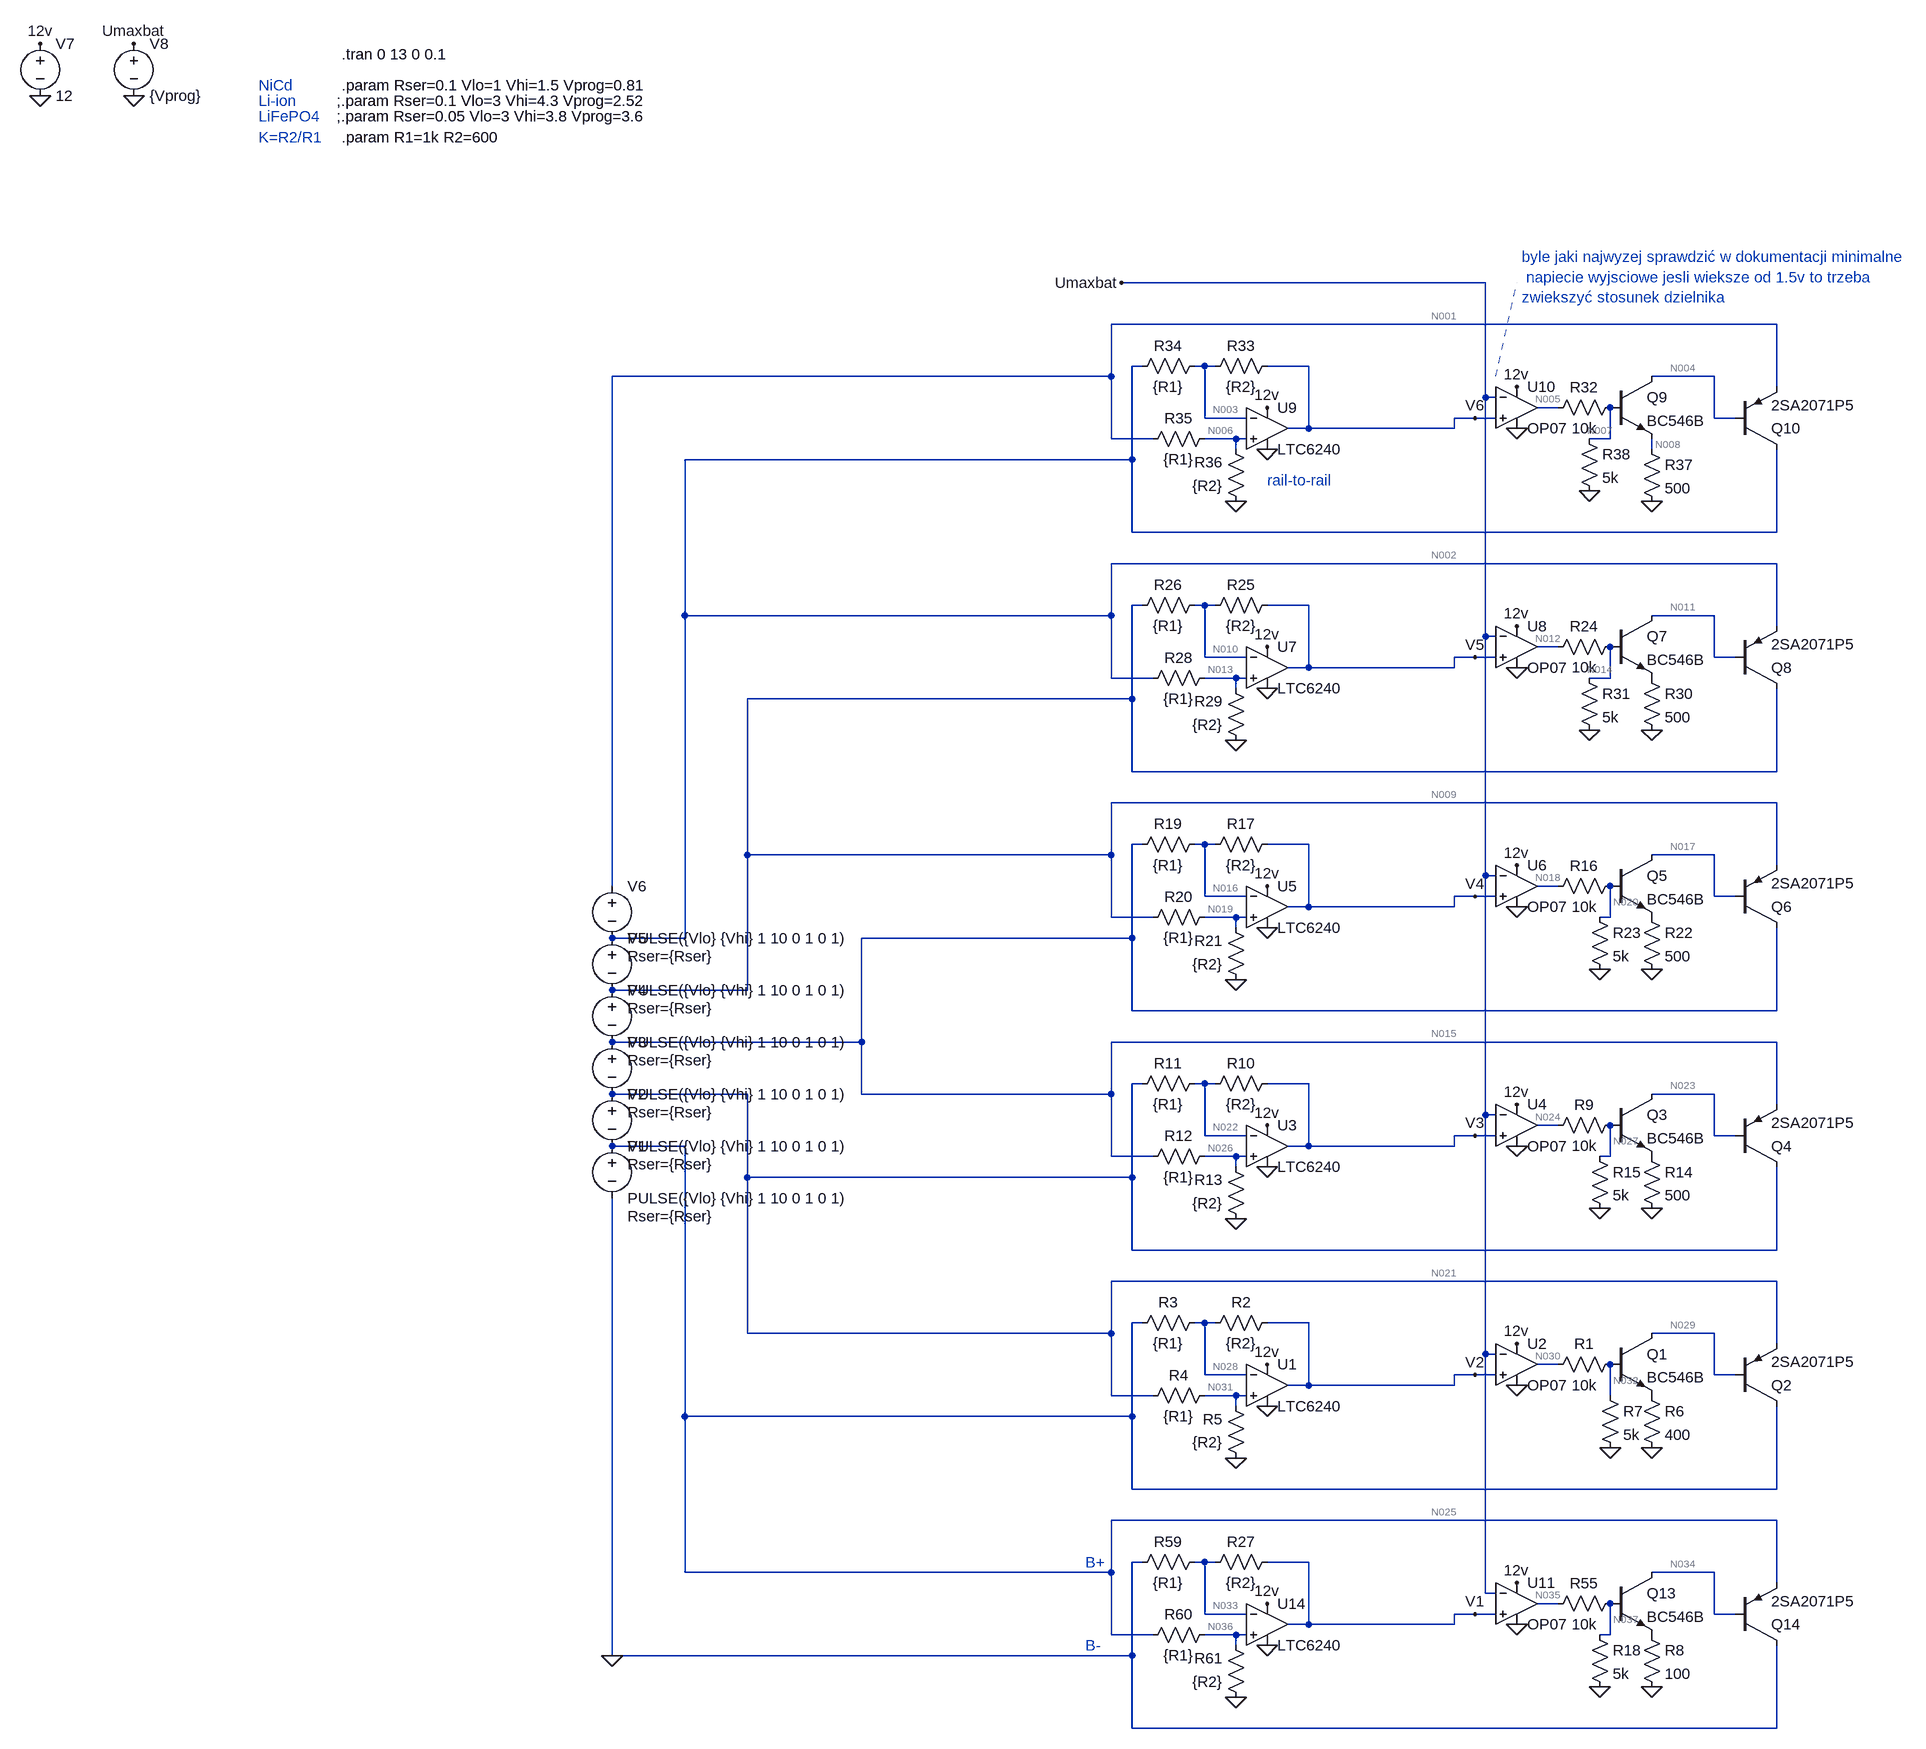
[diagram p0: schematic balanser_ostateczna_wersja.asc]
* balanser_ostateczna_wersja.asc
V1 N025 0 PULSE({Vlo} {Vhi} 1 10 0 1 0 1) Rser={Rser}
V7 12v 0 12
V8 Umaxbat 0 {Vprog}
R55 N037 N035 10k
R27 V1 N033 {R2}
R59 N033 0 {R1}
R60 N036 N025 {R1}
R61 0 N036 {R2}
Q13 N034 N037 P001 0 BC546B
Q14 0 N034 N025 0 2SA2071P5
V2 N021 N025 PULSE({Vlo} {Vhi} 1 10 0 1 0 1) Rser={Rser}
V3 N015 N021 PULSE({Vlo} {Vhi} 1 10 0 1 0 1) Rser={Rser}
V4 N009 N015 PULSE({Vlo} {Vhi} 1 10 0 1 0 1) Rser={Rser}
V5 N002 N009 PULSE({Vlo} {Vhi} 1 10 0 1 0 1) Rser={Rser}
V6 N001 N002 PULSE({Vlo} {Vhi} 1 10 0 1 0 1) Rser={Rser}
* U14: LTC6240 (symbol OpAmps\LTC6240 not available, pins judged from their places): In+=N036 In-=N033 V+=12v V-=0 OUT=V1
XU11 V1 Umaxbat 12v 0 N035 LT1001  ; OP07, pins In+ In- V+ V- OUT
R8 P001 0 100
R18 N037 0 5k
R1 N032 N030 10k
R2 V2 N028 {R2}
R3 N028 N025 {R1}
R4 N031 N021 {R1}
R5 0 N031 {R2}
Q1 N029 N032 P002 0 BC546B
Q2 N025 N029 N021 0 2SA2071P5
* U1: LTC6240 (symbol OpAmps\LTC6240 not available, pins judged from their places): In+=N031 In-=N028 V+=12v V-=0 OUT=V2
XU2 V2 Umaxbat 12v 0 N030 LT1001  ; OP07, pins In+ In- V+ V- OUT
R6 P002 0 400
R7 N032 0 5k
R9 N027 N024 10k
R10 V3 N022 {R2}
R11 N022 N021 {R1}
R12 N026 N015 {R1}
R13 0 N026 {R2}
Q3 N023 N027 P003 0 BC546B
Q4 N021 N023 N015 0 2SA2071P5
* U3: LTC6240 (symbol OpAmps\LTC6240 not available, pins judged from their places): In+=N026 In-=N022 V+=12v V-=0 OUT=V3
XU4 V3 Umaxbat 12v 0 N024 LT1001  ; OP07, pins In+ In- V+ V- OUT
R14 P003 0 500
R15 N027 0 5k
R16 N020 N018 10k
R17 V4 N016 {R2}
R19 N016 N015 {R1}
R20 N019 N009 {R1}
R21 0 N019 {R2}
Q5 N017 N020 P004 0 BC546B
Q6 N015 N017 N009 0 2SA2071P5
* U5: LTC6240 (symbol OpAmps\LTC6240 not available, pins judged from their places): In+=N019 In-=N016 V+=12v V-=0 OUT=V4
XU6 V4 Umaxbat 12v 0 N018 LT1001  ; OP07, pins In+ In- V+ V- OUT
R22 P004 0 500
R23 N020 0 5k
R24 N014 N012 10k
R25 V5 N010 {R2}
R26 N010 N009 {R1}
R28 N013 N002 {R1}
R29 0 N013 {R2}
Q7 N011 N014 P005 0 BC546B
Q8 N009 N011 N002 0 2SA2071P5
* U7: LTC6240 (symbol OpAmps\LTC6240 not available, pins judged from their places): In+=N013 In-=N010 V+=12v V-=0 OUT=V5
XU8 V5 Umaxbat 12v 0 N012 LT1001  ; OP07, pins In+ In- V+ V- OUT
R30 P005 0 500
R31 N014 0 5k
R32 N007 N005 10k
R33 V6 N003 {R2}
R34 N003 N002 {R1}
R35 N006 N001 {R1}
R36 0 N006 {R2}
Q9 N004 N007 N008 0 BC546B
Q10 N002 N004 N001 0 2SA2071P5
* U9: LTC6240 (symbol OpAmps\LTC6240 not available, pins judged from their places): In+=N006 In-=N003 V+=12v V-=0 OUT=V6
XU10 V6 Umaxbat 12v 0 N005 LT1001  ; OP07, pins In+ In- V+ V- OUT
R37 N008 0 500
R38 N007 0 5k
.model NPN NPN
.model PNP PNP
.lib standard.bjt
.tran 0 13 0 0.1
* B+
* B-
.param Rser=0.1 Vlo=1 Vhi=1.5 Vprog=0.81
* NiCd
* Li-ion
;.param Rser=0.1 Vlo=3 Vhi=4.3 Vprog=2.52
* LiFePO4
;.param Rser=0.05 Vlo=3 Vhi=3.8 Vprog=3.6
* K=R2/R1
.param R1=1k R2=600
* rail-to-rail
* byle jaki najwyzej sprawdzić w dokumentacji minimalne
*  napiecie wyjsciowe jesli wieksze od 1.5v to trzeba
* zwiekszyć stosunek dzielnika
.lib LTC.lib
.backanno
.end

* Results of the author's LTspice run, read from the files saved beside the schematic
* Operating Point, zero values left out:
*   V(n025) = 997.9 mV
*   V(12v) = 12 V
*   V(umaxbat) = 810 mV
*   V(n037) = 309.6 mV
*   V(n035) = 928.8 mV
*   V(v1) = 598.8 mV
*   V(n033) = 374.2 mV
*   V(n036) = 374.2 mV
*   V(n034) = 654.7 mV
*   V(p001) = 342.9 nV
*   V(n021) = 1.996 V
*   V(n015) = 2.994 V
*   V(n009) = 3.993 V
*   V(n002) = 4.992 V
*   V(n001) = 5.991 V
*   V(n032) = 309.6 mV
*   V(n030) = 928.8 mV
*   V(v2) = 598.8 mV
*   V(n028) = 748.5 mV
*   V(n031) = 748.5 mV
*   V(n029) = 1.652 V
*   V(p002) = 1.393 µV
*   V(n027) = 309.6 mV
*   V(n024) = 928.8 mV
*   V(v3) = 599 mV
*   V(n022) = 1.123 V
*   V(n026) = 1.123 V
*   V(n023) = 2.65 V
*   V(p003) = 1.769 µV
*   V(n020) = 309.6 mV
*   V(n018) = 928.8 mV
*   V(v4) = 599.2 mV
*   V(n016) = 1.497 V
*   V(n019) = 1.497 V
*   V(n017) = 3.648 V
*   V(p004) = 1.796 µV
*   V(n014) = 309.6 mV
*   V(n012) = 928.8 mV
*   V(v5) = 599.4 mV
*   V(n010) = 1.872 V
*   V(n013) = 1.872 V
*   V(n011) = 4.647 V
*   V(p005) = 1.823 µV
*   V(n007) = 309.6 mV
*   V(n005) = 928.8 mV
*   V(v6) = 599.8 mV
*   V(n003) = 2.247 V
*   V(n006) = 2.247 V
*   V(n004) = 5.646 V
*   V(n008) = 1.85 µV
*   Ic(Q13) = 3.409 nA
*   Ib(Q13) = 19.94 pA
*   Ie(Q13) = -3.429 nA
*   Ic(Q1) = 3.464 nA
*   Ib(Q1) = 18.94 pA
*   Ie(Q1) = -3.483 nA
*   Ic(Q3) = 3.519 nA
*   Ib(Q3) = 17.94 pA
*   Ie(Q3) = -3.537 nA
*   Ic(Q5) = 3.575 nA
*   Ib(Q5) = 16.95 pA
*   Ie(Q5) = -3.592 nA
*   Ic(Q7) = 3.63 nA
*   Ib(Q7) = 15.95 pA
*   Ie(Q7) = -3.646 nA
*   Ic(Q9) = 3.685 nA
*   Ib(Q9) = 14.95 pA
*   Ie(Q9) = -3.7 nA
*   Ic(Q14) = -406.5 nA
*   Ib(Q14) = -3.409 nA
*   Ie(Q14) = 409.9 nA
*   Ic(Q2) = -414.2 nA
*   Ib(Q2) = -3.464 nA
*   Ie(Q2) = 417.7 nA
*   Ic(Q4) = -422 nA
*   Ib(Q4) = -3.519 nA
*   Ie(Q4) = 425.6 nA
*   Ic(Q6) = -429.9 nA
*   Ib(Q6) = -3.575 nA
*   Ie(Q6) = 433.4 nA
*   Ic(Q8) = -437.7 nA
*   Ib(Q8) = -3.63 nA
*   Ie(Q8) = 441.3 nA
*   Ic(Q10) = -445.6 nA
*   Ib(Q10) = -3.685 nA
*   Ie(Q10) = 449.3 nA
*   I(R55) = -61.92 µA
*   I(R27) = 374.2 µA
*   I(R59) = 374.2 µA
*   I(R60) = -623.7 µA
*   I(R61) = -623.7 µA
*   I(R8) = 3.429 nA
*   I(R18) = 61.92 µA
*   I(R1) = -61.92 µA
*   I(R2) = -249.5 µA
*   I(R3) = -249.5 µA
*   I(R4) = -1.247 mA
*   I(R5) = -1.247 mA
*   I(R6) = 3.483 nA
*   I(R7) = 61.92 µA
*   I(R9) = -61.92 µA
*   I(R10) = -873.1 µA
*   I(R11) = -873.1 µA
*   I(R12) = -1.871 mA
*   I(R13) = -1.871 mA
*   I(R14) = 3.537 nA
*   I(R15) = 61.92 µA
*   I(R16) = -61.92 µA
*   I(R17) = -1.497 mA
*   I(R19) = -1.497 mA
*   I(R20) = -2.495 mA
*   I(R21) = -2.495 mA
*   I(R22) = 3.592 nA
*   I(R23) = 61.92 µA
*   I(R24) = -61.92 µA
*   I(R25) = -2.121 mA
*   I(R26) = -2.121 mA
*   I(R28) = -3.12 mA
*   I(R29) = -3.12 mA
*   I(R30) = 3.646 nA
*   I(R31) = 61.92 µA
*   I(R32) = -61.92 µA
*   I(R33) = -2.745 mA
*   I(R34) = -2.745 mA
*   I(R35) = -3.745 mA
*   I(R36) = -3.745 mA
*   I(R37) = 3.7 nA
*   I(R38) = 61.92 µA
*   I(V1) = -20.59 mA
*   I(V7) = -32.1 mA
*   I(V8) = -17.02 nA
*   I(V2) = -19.72 mA
*   I(V3) = -17.59 mA
*   I(V4) = -14.23 mA
*   I(V5) = -9.61 mA
*   I(V6) = -3.745 mA
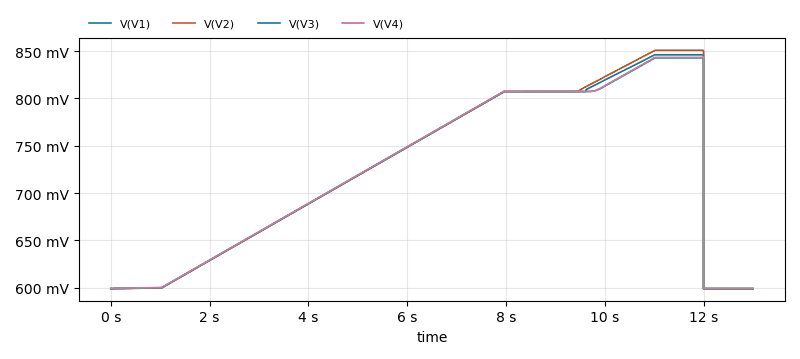
[diagram p1: Transient Analysis of balanser_ostateczna_wersja.asc, plotted from the saved traces]
* Transient Analysis, 1 run:
*   V(V1): min 598.7 mV, max 846.2 mV, average 724.5 mV, rms 730.4 mV, last 598.8 mV
*   V(V2): min 598.7 mV, max 850.9 mV, average 725.4 mV, rms 731.3 mV, last 598.8 mV
*   V(V3): min 598.9 mV, max 842.8 mV, average 723.9 mV, rms 729.6 mV, last 599 mV
*   V(V4): min 599.1 mV, max 843.4 mV, average 724.1 mV, rms 729.8 mV, last 599.2 mV